# Altium schematic sheet 23_IMU_GPS.SchDoc (part 1 of 2)
size A3; SheetNumber: 24; SheetTotal: 24
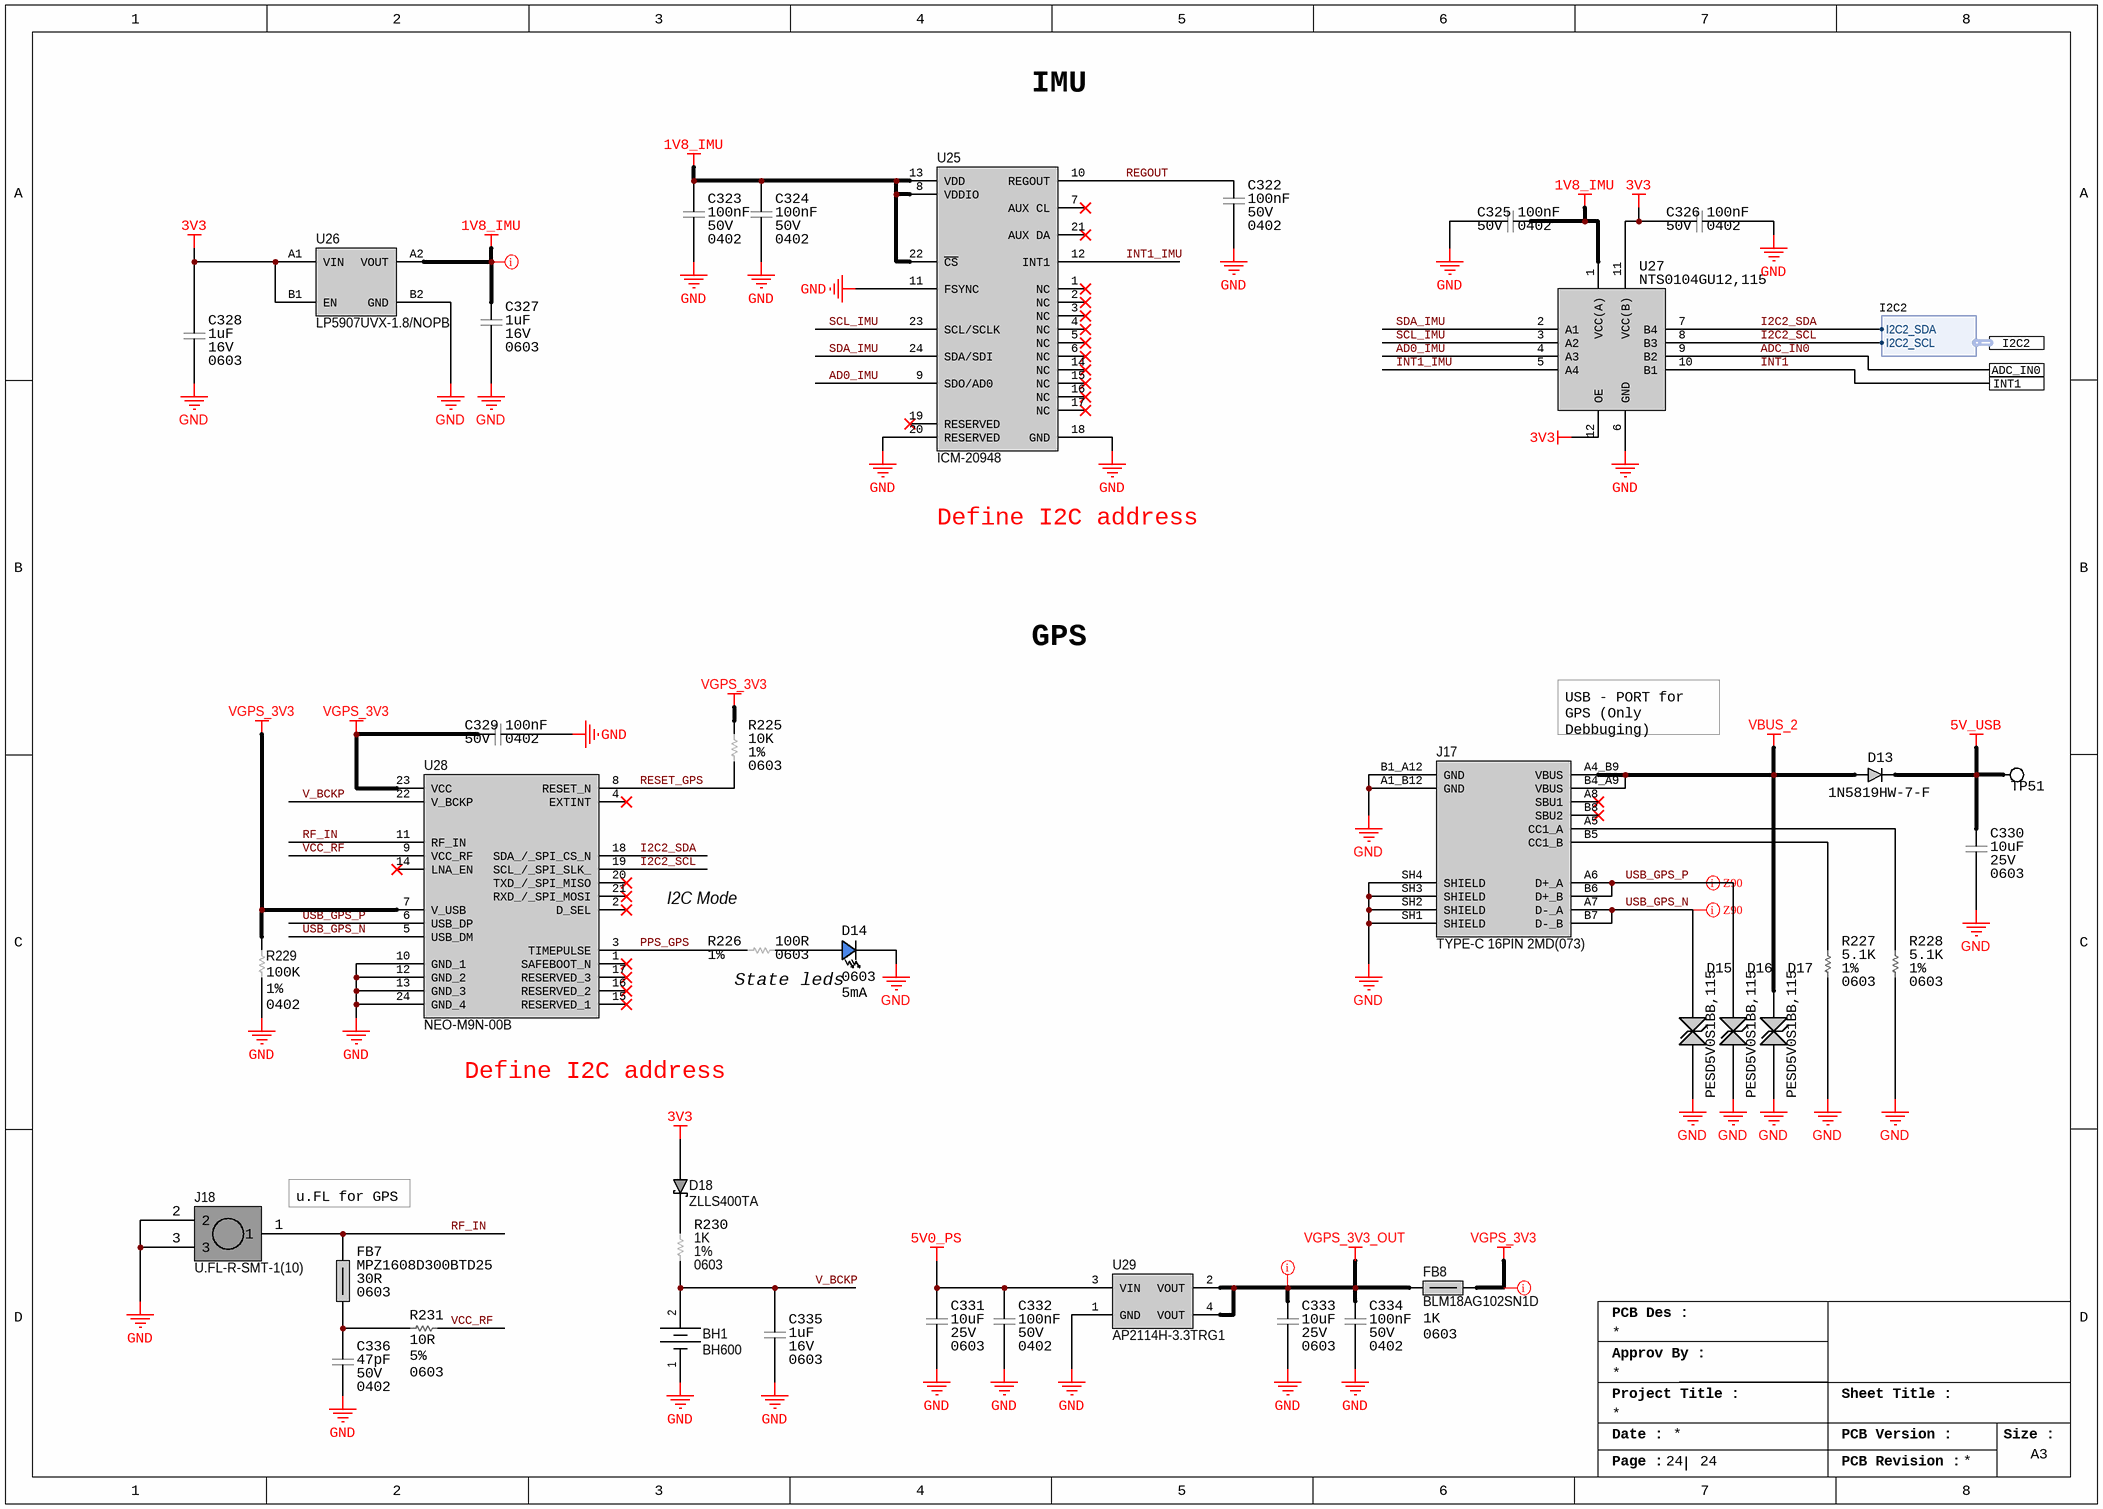
[diagram p0: 23_IMU_GPS.SchDoc]

## Parts
BH1  BH600  [MECH_BATTERY_HOLDER_BH600]
C322  Voltage Rating: 50V  Capacitance: 100nF  Case/Package: 0402  [CAP_0402_CAPC1005X05N]  (hidden comment: GRM155R71H104KE14D)
C323  Voltage Rating: 50V  Capacitance: 100nF  Case/Package: 0402  [CAP_0402_CAPC1005X05N]  (hidden comment: GRM155R71H104KE14D)
C324  Voltage Rating: 50V  Capacitance: 100nF  Case/Package: 0402  [CAP_0402_CAPC1005X05N]  (hidden comment: GRM155R71H104KE14D)
C325  Voltage Rating: 50V  Capacitance: 100nF  Case/Package: 0402  [CAP_0402_CAPC1005X05N]  (hidden comment: GRM155R71H104KE14D)
C326  Voltage Rating: 50V  Capacitance: 100nF  Case/Package: 0402  [CAP_0402_CAPC1005X05N]  (hidden comment: GRM155R71H104KE14D)
C327  Voltage Rating: 16V  Capacitance: 1uF  Case/Package: 0603  [CAP_0603_CAPC1608X08N]  (hidden comment: CL10A105KO8NNNC)
C328  Voltage Rating: 16V  Capacitance: 1uF  Case/Package: 0603  [CAP_0603_CAPC1608X08N]  (hidden comment: CL10A105KO8NNNC)
C329  Voltage Rating: 50V  Capacitance: 100nF  Case/Package: 0402  [CAP_0402_CAPC1005X05N]  (hidden comment: GRM155R71H104KE14D)
C330  Case/Package: 0603  Capacitance: 10uF  Voltage Rating: 25V  [CAP_0603_CAPC1608X08N]  (hidden comment: GRM188R61E106MA73D)
C331  Case/Package: 0603  Capacitance: 10uF  Voltage Rating: 25V  [CAP_0603_CAPC1608X08N]  (hidden comment: GRM188R61E106MA73D)
C332  Voltage Rating: 50V  Capacitance: 100nF  Case/Package: 0402  [CAP_0402_CAPC1005X05N]  (hidden comment: GRM155R71H104KE14D)
C333  Case/Package: 0603  Capacitance: 10uF  Voltage Rating: 25V  [CAP_0603_CAPC1608X08N]  (hidden comment: GRM188R61E106MA73D)
C334  Voltage Rating: 50V  Capacitance: 100nF  Case/Package: 0402  [CAP_0402_CAPC1005X05N]  (hidden comment: GRM155R71H104KE14D)
C335  Voltage Rating: 16V  Capacitance: 1uF  Case/Package: 0603  [CAP_0603_CAPC1608X08N]  (hidden comment: CL10A105KO8NNNC)
C336  Voltage Rating: 50V  Case/Package: 0402  Capacitance: 47pF  [CAP_0402_CAPC1005X05N]  (hidden comment: GCQ1555C1H470JB01D)
D13  1N5819HW-7-F  [DIO_SOD3716X145N]
D14  Case Code (Imperial): 0603  Test Current: 5mA  [LED_0603-BLUE-0.75mm]  (hidden comment: LTST-C193TBKT-5A)
D15  PESD5V0S1BB,115  [DIO_TVS_SODFL1608X65N]
D16  PESD5V0S1BB,115  [DIO_TVS_SODFL1608X65N]
D17  PESD5V0S1BB,115  [DIO_TVS_SODFL1608X65N]
D18  ZLLS400TA  [DIO_SOD2512X113N]
FB7  MPZ1608D300BTD25  Impedance: 30R  Case/Package: 0603  [IND_0603_INDC1608X08N]
FB8  BLM18AG102SN1D  Impedance: 1K  Case/Package: 0603  [IND_0603_INDC1608X08N]
J17  TYPE-C 16PIN 2MD(073)  [CONN_USB_C_16P]
J18  U.FL-R-SMT-1(10)  [CONN_UFL_U.FL-R-SMT-1(10)]
R225  Resistance: 10K  Tolerance: 1%  Case/Package: 0603  [RES_0603_RESC1608X04N]  (hidden comment: AC0603FR-1010KL)
R226  Case Code (Imperial): 0603  Tolerance: 1%  Resistance: 100R  [CAP_0603_CAPC1608X08N]  (hidden comment: ERJ3EKF1000V)
R227  Tolerance: 1%  Resistance: 5.1K  Case/Package: 0603  [RES_0603_RESC1608X04N]  (hidden comment: RC0603FR-075K1L)
R228  Tolerance: 1%  Resistance: 5.1K  Case/Package: 0603  [RES_0603_RESC1608X04N]  (hidden comment: RC0603FR-075K1L)
R229  Resistance: 100K  Tolerance: 1%  Case/Package: 0402  [RES_0402_RESC1005X04N]  (hidden comment: RC0402FR-07100KL)
R230  Resistance: 1K  Tolerance: 1%  Case/Package: 0603  [RES_0603_RESC1608X04N]  (hidden comment: AC0603FR-101KL)
R231  Resistance: 10R  Tolerance: 5%  Case/Package: 0603  [RES_0603_RESC1608X04N]  (hidden comment: RC0603JR-0710RL)
TP51  NO COMPONENT  [TP_PAD_0.5MM_SMD_ROUND]  (value not drawn)  (no BOM)
U25  ICM-20948  [IC_IMU_TDK_InvenSense_0_IPC_A]
U26  LP5907UVX-1.8/NOPB  [IC_REG_LDO_BGA4C35P2X2_71X71X40]
U27  NTS0104GU12,115  [IC_LEVEL_TRASLATOR_XQFN12_0P4_1P8X2P1]
U28  NEO-M9N-00B  [IC_MODULE_UBLOX_NEOM9N00B]
U29  AP2114H-3.3TRG1  [IC_REG_SOT230P700X180-4N]

## Ports
ADC_IN0, I2C2 (harness I2C2), INT1

## Harnesses
I2C2: I2C2_SDA, I2C2_SCL

## Nets
1V8_IMU: C323.2 C324.2 C325.2 C327.2 U25.8(VDDIO) U25.13(VDD) U25.22(~{CS}) U26.A2(VOUT) U27.1(VCC(A))
3V3: C326.1 C328.2 D18.2(A) U26.A1(VIN) U26.B1(EN) U27.11(VCC(B)) U27.12(OE)
5V0_PS: C331.2 C332.2 U29.3(VIN)
5V_USB: C330.2 D13.1(K) TP51.1
GND: BH1.1(-) C322.1 C323.1 C324.1 C325.1 C326.2 C327.1 C328.1 C329.2 C330.1 C331.1 C332.1 C333.1 C334.1 C335.1 C336.1 D14.1(C) D15.1(K1) D16.1(K1) D17.1(K1) J17.A1_B12(GND) J17.B1_A12(GND) J17.SH1(SHIELD) J17.SH2(SHIELD) J17.SH3(SHIELD) J17.SH4(SHIELD) J18.2 J18.3 R227.1 R228.1 R229.1 U25.11(FSYNC) U25.18(GND) U25.20(RESERVED) U26.B2(GND) U27.6(GND) U28.10(GND_1) U28.12(GND_2) U28.13(GND_3) U28.24(GND_4) U29.1(GND)
VBUS_2: D13.2(A) D17.2(K2) J17.A4_B9(VBUS) J17.B4_A9(VBUS)
VGPS_3V3: C329.1 FB8.2 R225.2 R229.2 U28.7(V_USB) U28.23(VCC)
VGPS_3V3_OUT: C333.2 C334.2 FB8.1 U29.2(VOUT) U29.4(VOUT)
AD0_IMU: U25.9(SDO/AD0) U27.4(A3)
ADC_IN0: U27.9(B2) ; port ADC_IN0
I2C2_SCL: U27.8(B3) U28.19(SCL_/_SPI_SLK_) ; port I2C2.I2C2_SCL
I2C2_SDA: U27.7(B4) U28.18(SDA_/_SPI_CS_N) ; port I2C2.I2C2_SDA
INT1: U27.10(B1) ; port INT1
INT1_IMU: U25.12(INT1) U27.5(A4)
PPS_GPS: R226.1 U28.3(TIMEPULSE)
REGOUT: C322.2 U25.10(REGOUT)
RESET_GPS: R225.1 U28.8(RESET_N)
RF_IN: FB7.2 J18.1 U28.11(RF_IN)
SCL_IMU: U25.23(SCL/SCLK) U27.3(A2)
SDA_IMU: U25.24(SDA/SDI) U27.2(A1)
USB_GPS_N: D15.2(K2) J17.A7(D-_A) J17.B7(D-_B) U28.5(USB_DM)
USB_GPS_P: D16.2(K2) J17.A6(D+_A) J17.B6(D+_B) U28.6(USB_DP)
V_BCKP: BH1.2(+) C335.2 R230.1 U28.22(V_BCKP)
VCC_RF: R231.2 U28.9(VCC_RF)
NetC336_2: C336.2 FB7.1 R231.1
NetD14_2: D14.2(A) R226.2
NetD18_1: D18.1(K) R230.2
NetJ17_A5: J17.A5(CC1_A) R228.2
NetJ17_B5: J17.B5(CC1_B) R227.2

Not connected (* = marked no-connect by the designer): J17 A8(SBU1)* B8(SBU2)*; U25 1(NC)* 2(NC)* 3(NC)* 4(NC)* 5(NC)* 6(NC)* 7(AUX_CL)* 14(NC)* 15(NC)* 16(NC)* 17(NC)* 19(RESERVED)* 21(AUX_DA)*; U28 1(SAFEBOOT_N)* 2(D_SEL)* 4(EXTINT)* 14(LNA_EN)* 15(RESERVED_1)* 16(RESERVED_2)* 17(RESERVED_3)* 20(TXD_/_SPI_MISO)* 21(RXD_/_SPI_MOSI)*

## Layout directives
differential pair; differential pair class Z90; net class Z90: USB_GPS_N, USB_GPS_P
net class PWR: 1V8_IMU, VGPS_3V3, VGPS_3V3_OUT

## Notes on the sheet
- IMU
- Define I2C address
- GPS
- (near J17) USB - PORT for GPS (Only Debbuging)
- (near R226) I2C Mode
- State leds
- (near J18) u.FL for GPS
- PCB Des :
- Approv By :
- Project Title :
- Sheet Title :
- Date :
- PCB Version :
- Size :
- A3
- Page :
- PCB Revision :